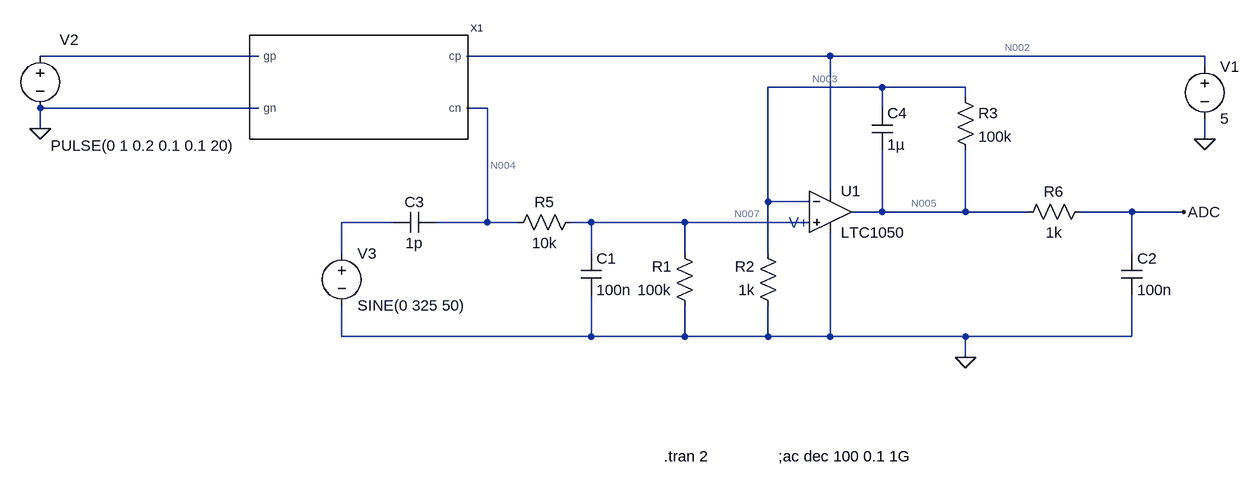
[diagram p0: schematic Draft4.asc]
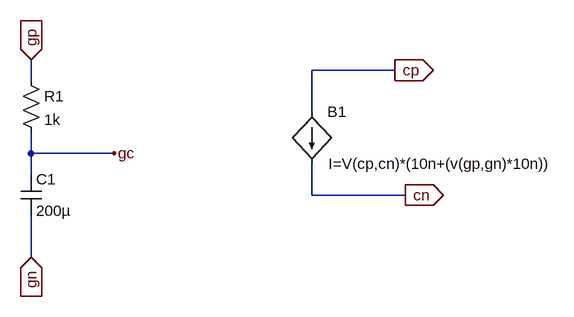
[diagram p1: sub-circuit capteur.asc]
Draft4.asc, the LTspice schematic file:
Version 4
SHEET 1 984 680
WIRE -528 -208 -864 -208
WIRE 352 -208 -208 -208
WIRE 928 -208 352 -208
WIRE 928 -192 928 -208
WIRE 432 -160 256 -160
WIRE 560 -160 432 -160
WIRE 560 -144 560 -160
WIRE -528 -128 -864 -128
WIRE -176 -128 -208 -128
WIRE 432 -128 432 -160
WIRE -864 -96 -864 -128
WIRE 928 -80 928 -112
WIRE 352 0 352 -208
WIRE 256 16 256 -160
WIRE 320 16 256 16
WIRE 432 32 432 -64
WIRE 432 32 384 32
WIRE 560 32 560 -64
WIRE 560 32 432 32
WIRE 656 32 560 32
WIRE 816 32 736 32
WIRE 896 32 816 32
WIRE -320 48 -400 48
WIRE -176 48 -176 -128
WIRE -176 48 -256 48
WIRE -128 48 -176 48
WIRE -16 48 -48 48
WIRE 128 48 -16 48
WIRE 320 48 128 48
WIRE -400 96 -400 48
WIRE -16 96 -16 48
WIRE 128 96 128 48
WIRE 256 96 256 16
WIRE 816 96 816 32
WIRE -400 224 -400 176
WIRE -16 224 -16 160
WIRE -16 224 -400 224
WIRE 128 224 128 176
WIRE 128 224 -16 224
WIRE 256 224 256 176
WIRE 256 224 128 224
WIRE 352 224 352 64
WIRE 352 224 256 224
WIRE 560 224 352 224
WIRE 816 224 816 160
WIRE 816 224 560 224
WIRE 560 256 560 224
FLAG 928 -80 0
FLAG 560 256 0
FLAG 896 32 ADC
FLAG -864 -96 0
SYMBOL res -32 32 R90
WINDOW 0 0 56 VBottom 2
WINDOW 3 32 56 VTop 2
SYMATTR InstName R5
SYMATTR Value 10k
SYMBOL res 144 192 R180
WINDOW 0 36 76 Left 2
WINDOW 3 36 40 Left 2
SYMATTR InstName R1
SYMATTR Value 100k
SYMBOL res 272 192 R180
WINDOW 0 36 76 Left 2
WINDOW 3 36 40 Left 2
SYMATTR InstName R2
SYMATTR Value 1k
SYMBOL cap -32 96 R0
SYMATTR InstName C1
SYMATTR Value 100n
SYMBOL Opamps\\LTC1050 352 -32 R0
SYMATTR InstName U1
SYMBOL cap 416 -128 R0
SYMATTR InstName C4
SYMATTR Value 1µ
SYMBOL res 544 -160 R0
SYMATTR InstName R3
SYMATTR Value 100k
SYMBOL res 752 16 R90
WINDOW 0 0 56 VBottom 2
WINDOW 3 32 56 VTop 2
SYMATTR InstName R6
SYMATTR Value 1k
SYMBOL cap 800 96 R0
SYMATTR InstName C2
SYMATTR Value 100n
SYMBOL voltage 928 -208 R0
SYMATTR InstName V1
SYMATTR Value 5
SYMBOL Capteur -368 -176 R0
SYMATTR InstName X1
SYMBOL voltage -864 -224 R0
WINDOW 0 30 -9 Left 2
WINDOW 3 16 154 Left 2
WINDOW 123 0 0 Left 2
WINDOW 39 0 0 Left 2
SYMATTR InstName V2
SYMATTR Value PULSE(0 1 0.2 0.1 0.1 20)
SYMBOL cap -256 32 R90
WINDOW 0 0 32 VBottom 2
WINDOW 3 32 32 VTop 2
SYMATTR InstName C3
SYMATTR Value 1p
SYMBOL voltage -400 80 R0
WINDOW 123 0 0 Left 2
WINDOW 39 0 0 Left 2
SYMATTR InstName V3
SYMATTR Value SINE(0 325 50)
TEXT 96 408 Left 2 !.tran 2
TEXT 288 48 Left 2 ;V+
TEXT 272 408 Left 2 !;ac dec 100 0.1 1G

capteur.asc, the sub-circuit schematic file:
Version 4
SHEET 1 11528 17624
WIRE 11280 17248 11152 17248
WIRE 10720 17264 10720 17232
WIRE 11152 17312 11152 17248
WIRE 10720 17376 10720 17344
WIRE 10848 17376 10720 17376
WIRE 10720 17408 10720 17376
WIRE 11152 17440 11152 17392
WIRE 11296 17440 11152 17440
WIRE 10720 17536 10720 17472
FLAG 10720 17536 gn
IOPIN 10720 17536 In
FLAG 10720 17232 gp
IOPIN 10720 17232 In
FLAG 10848 17376 gc
FLAG 11280 17248 cp
IOPIN 11280 17248 Out
FLAG 11296 17440 cn
IOPIN 11296 17440 Out
SYMBOL res 10704 17248 R0
SYMATTR InstName R1
SYMATTR Value 1k
SYMBOL cap 10704 17408 R0
SYMATTR InstName C1
SYMATTR Value 200µ
SYMBOL bi 11152 17312 R0
WINDOW 3 372 80 Right 2
SYMATTR Value I=V(cp,cn)*(10n+(v(gp,gn)*10n))
SYMATTR InstName B1

The netlist it stands for:
* Draft4.asc
R5 N007 N004 10k
R1 0 N007 100k
R2 0 N003 1k
C1 N007 0 100n
XU1 N007 N003 N002 0 N005 LTC1050  ; pins In+ In- V+ V- OUT
C4 N003 N005 1µ
R3 N003 N005 100k
R6 ADC N005 1k
C2 ADC 0 100n
V1 N002 0 5
XX1 N002 N004 0 N001 capteur
V2 N001 0 PULSE(0 1 0.2 0.1 0.1 20)
C3 N004 N006 1p
V3 N006 0 SINE(0 325 50)

* block symbol definitions
.subckt capteur cp cn gn gp
R1 gp gc 1k
C1 gc gn 200µ
B1 cp cn I=V(cp,cn)*(10n+(v(gp,gn)*10n))
.ends capteur

.tran 2
* V+
;ac dec 100 0.1 1G
.lib LTC.lib
.backanno
.end

* Results of the author's LTspice run, read from the files saved beside the schematic
* Operating Point, zero values left out:
*   V(n007) = 4.995 mV
*   V(n004) = 5.494 mV
*   V(n003) = 4.995 mV
*   V(n002) = 5 V
*   V(n005) = 504.4 mV
*   V(adc) = 504.4 mV
*   I(R3) = -4.995 µA
*   I(R2) = -4.995 µA
*   I(R1) = -49.95 nA
*   I(R5) = -49.95 nA
*   I(V1) = -754.2 µA
*   Ix(u1:3) = 754.1 µA
*   Ix(u1:4) = -749.1 µA
*   Ix(u1:5) = -4.995 µA
*   Ix(x1:CP) = 49.95 nA
*   Ix(x1:CN) = -49.95 nA